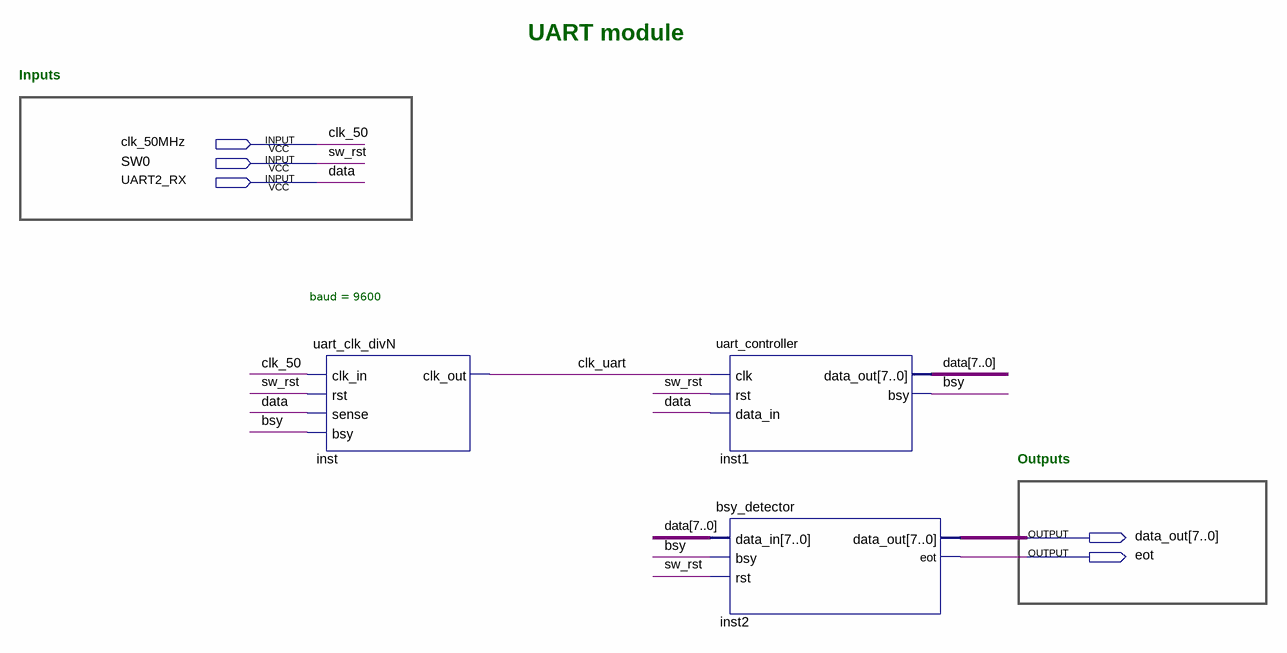
[diagram p0: schematic sheet]
// Quartus schematic UART.bdf as structural Verilog: 3 symbols, 5 pins
module UART (
  input  clk_50MHz,
  input  SW0,
  input  UART2_RX,
  output [7:0] data_out,
  output eot
);

  wire bsy, clk_uart;
  wire [7:0] data;

  uart_clk_divN #(.baud(9600)) inst (.clk_in(clk_50MHz), .rst(SW0), .sense(UART2_RX), .bsy(bsy), .clk_out(clk_uart));
  uart_controller inst1 (.clk(clk_uart), .rst(SW0), .data_in(UART2_RX), .data_out(data), .bsy(bsy));
  bsy_detector inst2 (.data_in(data), .bsy(bsy), .rst(SW0), .data_out(data_out), .eot(eot));

  // Other names for the same wires on the sheet: clk_50 = clk_50MHz; data = UART2_RX; sw_rst = SW0

  // Notes on the sheet:
  //   UART module
  //   Inputs
  //   Outputs
endmodule
